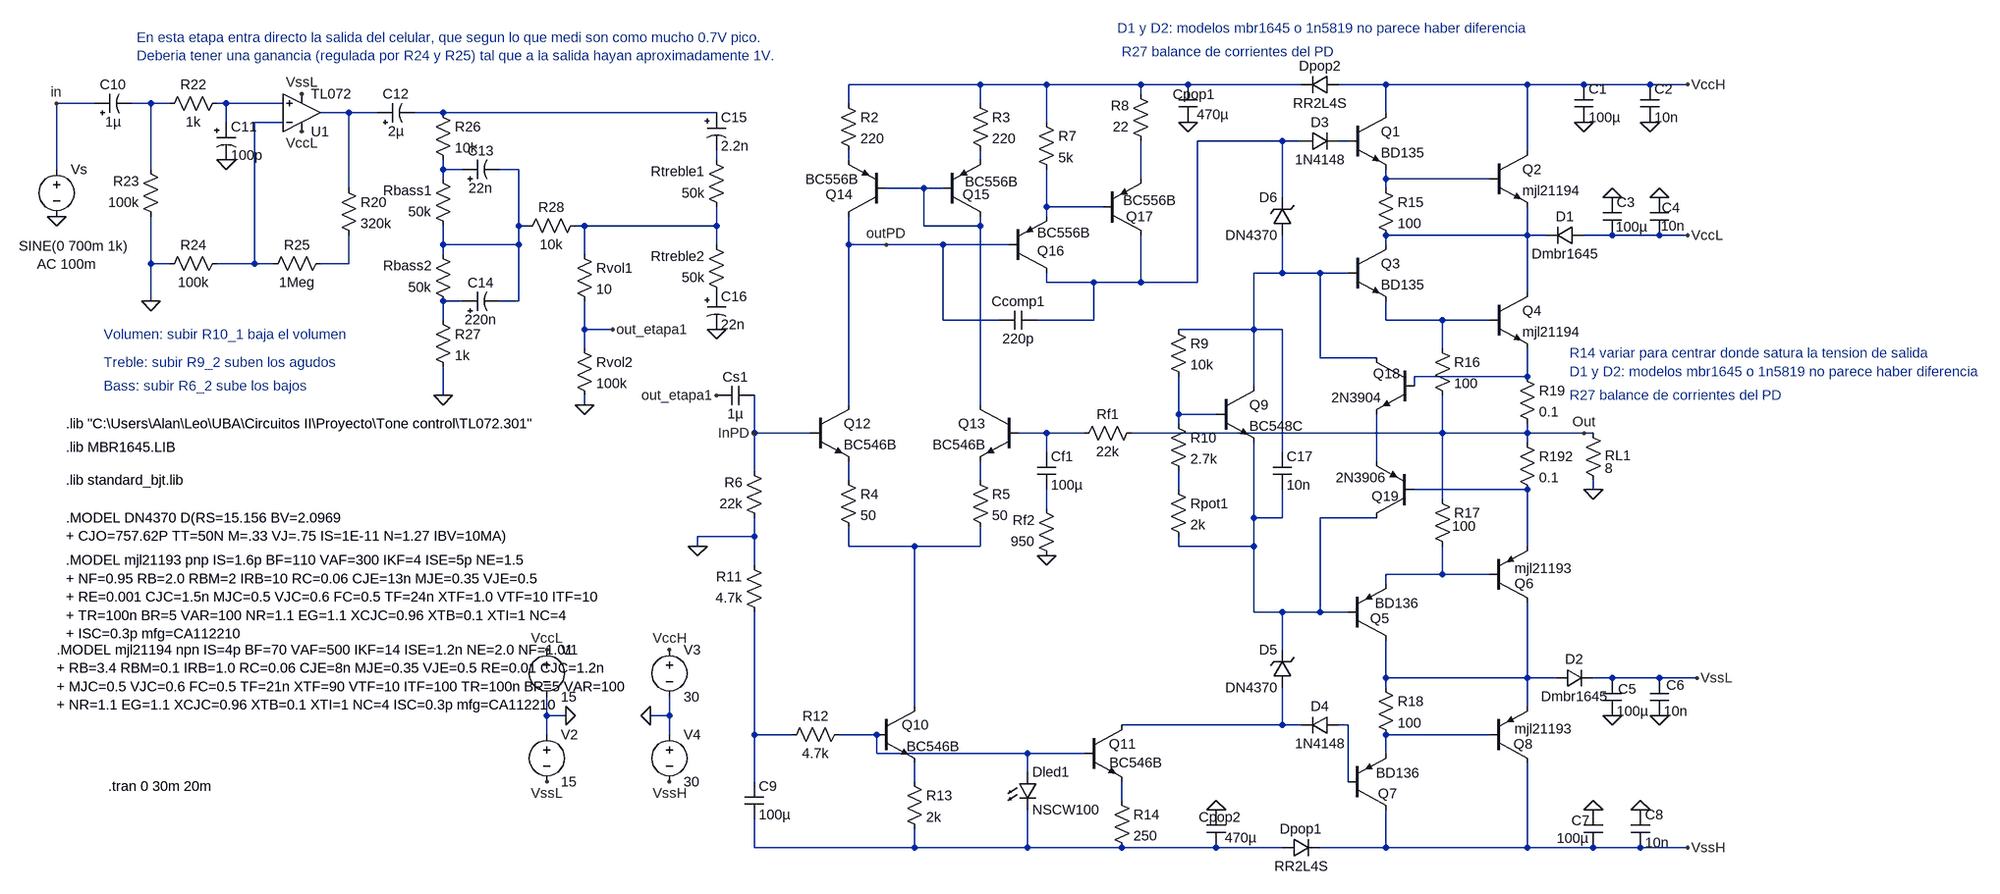
[diagram p0: schematic circuito_completo.asc]
circuito_completo.asc, the LTspice schematic file:
Version 4
SHEET 1 3596 1496
WIRE 1328 16 1104 16
WIRE 1440 16 1328 16
WIRE 1600 16 1440 16
WIRE 1680 16 1600 16
WIRE 1872 16 1680 16
WIRE 2016 16 1936 16
WIRE 2256 16 2016 16
WIRE 2352 16 2256 16
WIRE 2464 16 2352 16
WIRE 2528 16 2464 16
WIRE 1600 32 1600 16
WIRE -176 48 -240 48
WIRE -80 48 -112 48
WIRE -48 48 -80 48
WIRE 48 48 32 48
WIRE 144 48 48 48
WIRE 1104 48 1104 16
WIRE 1328 48 1328 16
WIRE 256 64 208 64
WIRE 304 64 256 64
WIRE 416 64 368 64
WIRE 880 64 416 64
WIRE 2016 64 2016 16
WIRE 48 80 48 48
WIRE 144 80 96 80
WIRE 1440 80 1440 16
WIRE 1840 112 1696 112
WIRE 1872 112 1840 112
WIRE 1952 112 1936 112
WIRE 2256 128 2256 16
WIRE 880 144 880 128
WIRE 1104 144 1104 128
WIRE 1328 144 1328 128
WIRE -240 160 -240 48
WIRE -80 160 -80 48
WIRE 416 160 416 144
WIRE 448 160 416 160
WIRE 544 160 512 160
WIRE 416 176 416 160
WIRE 1600 176 1600 112
WIRE 2016 176 2016 160
WIRE 2192 176 2016 176
WIRE 256 192 256 64
WIRE 1232 192 1168 192
WIRE 1264 192 1232 192
WIRE 2016 192 2016 176
WIRE 1840 208 1840 112
WIRE 1440 224 1440 160
WIRE 1536 224 1440 224
WIRE 1440 240 1440 224
WIRE 544 256 544 160
WIRE 560 256 544 256
WIRE 656 256 640 256
WIRE 880 256 880 224
WIRE 880 256 656 256
WIRE 1232 256 1232 192
WIRE 1328 256 1328 240
WIRE 1328 256 1232 256
WIRE 2256 272 2256 224
WIRE 2256 272 2016 272
WIRE 2288 272 2256 272
WIRE 2400 272 2352 272
WIRE 2480 272 2400 272
WIRE 2528 272 2480 272
WIRE 416 288 416 256
WIRE 544 288 544 256
WIRE 544 288 416 288
WIRE 880 288 880 256
WIRE 1104 288 1104 240
WIRE 1168 288 1104 288
WIRE 1264 288 1168 288
WIRE 1376 288 1264 288
WIRE 2016 288 2016 272
WIRE 416 304 416 288
WIRE 656 304 656 256
WIRE -80 320 -80 240
WIRE -48 320 -80 320
WIRE 96 320 96 80
WIRE 96 320 32 320
WIRE 128 320 96 320
WIRE 256 320 256 272
WIRE 256 320 208 320
WIRE 1840 336 1840 272
WIRE 1840 336 1792 336
WIRE 1904 336 1840 336
WIRE 1952 336 1904 336
WIRE 1440 352 1440 336
WIRE 1520 352 1440 352
WIRE 1600 352 1600 272
WIRE 1600 352 1520 352
WIRE 1696 352 1696 112
WIRE 1696 352 1600 352
WIRE 2256 368 2256 272
WIRE -80 384 -80 320
WIRE 448 384 416 384
WIRE 544 384 544 288
WIRE 544 384 512 384
WIRE 416 416 416 384
WIRE 1264 416 1264 288
WIRE 1360 416 1264 416
WIRE 1520 416 1520 352
WIRE 1520 416 1424 416
WIRE 2016 416 2016 384
WIRE 2112 416 2016 416
WIRE 2192 416 2112 416
WIRE 656 432 656 384
WIRE 704 432 656 432
WIRE 1792 432 1792 336
WIRE 1792 432 1664 432
WIRE 1840 432 1792 432
WIRE 656 464 656 432
WIRE 2112 464 2112 416
WIRE 1904 480 1904 336
WIRE 2000 480 1904 480
WIRE 2256 512 2256 464
WIRE 2256 512 2064 512
WIRE 1792 528 1792 432
WIRE 2064 528 2064 512
WIRE 416 544 416 496
WIRE 656 560 656 544
WIRE 1104 560 1104 288
WIRE 1328 560 1328 256
WIRE 1664 576 1664 512
WIRE 1728 576 1664 576
WIRE 1664 592 1664 576
WIRE 944 608 944 544
WIRE 1040 608 944 608
WIRE 1440 608 1392 608
WIRE 1504 608 1440 608
WIRE 2112 608 2112 544
WIRE 2112 608 1584 608
WIRE 2256 608 2256 592
WIRE 2256 608 2112 608
WIRE 2352 608 2256 608
WIRE 2368 608 2352 608
WIRE 2256 624 2256 608
WIRE 1440 640 1440 608
WIRE 1840 640 1840 432
WIRE 2000 656 2000 576
WIRE 944 672 944 608
WIRE 1104 688 1104 656
WIRE 1328 688 1328 656
WIRE 1664 704 1664 672
WIRE 2256 704 2064 704
WIRE 2368 704 2368 688
WIRE 2112 720 2112 608
WIRE 1440 736 1440 704
WIRE 1792 752 1792 624
WIRE 1840 752 1840 704
WIRE 1840 752 1792 752
WIRE 2000 752 1904 752
WIRE 944 784 944 752
WIRE 944 784 848 784
WIRE 848 800 848 784
WIRE 1104 800 1104 768
WIRE 1216 800 1104 800
WIRE 1328 800 1328 768
WIRE 1328 800 1216 800
WIRE 1664 800 1664 784
WIRE 1792 800 1792 752
WIRE 1792 800 1664 800
WIRE 2256 800 2256 704
WIRE 944 832 944 784
WIRE 2112 848 2112 800
WIRE 2112 848 2016 848
WIRE 2192 848 2112 848
WIRE 2016 864 2016 848
WIRE 1792 912 1792 800
WIRE 1840 912 1792 912
WIRE 1904 912 1904 752
WIRE 1904 912 1840 912
WIRE 1952 912 1904 912
WIRE 1840 976 1840 912
WIRE 2016 1024 2016 960
WIRE 2256 1024 2256 896
WIRE 2256 1024 2016 1024
WIRE 2304 1024 2256 1024
WIRE 2400 1024 2368 1024
WIRE 2480 1024 2400 1024
WIRE 2544 1024 2480 1024
WIRE 2016 1040 2016 1024
WIRE 1216 1072 1216 800
WIRE 2256 1072 2256 1024
WIRE 592 1088 592 1056
WIRE 624 1088 592 1088
WIRE 800 1088 800 1056
WIRE 800 1088 768 1088
WIRE 1840 1104 1840 1040
WIRE 1840 1104 1568 1104
WIRE 1872 1104 1840 1104
WIRE 1952 1104 1936 1104
WIRE 592 1120 592 1088
WIRE 800 1120 800 1088
WIRE 944 1120 944 912
WIRE 1008 1120 944 1120
WIRE 1152 1120 1088 1120
WIRE 2192 1120 2016 1120
WIRE 1152 1152 1152 1120
WIRE 1408 1152 1152 1152
WIRE 1504 1152 1408 1152
WIRE 2016 1152 2016 1120
WIRE 1408 1184 1408 1152
WIRE 944 1200 944 1120
WIRE 1216 1200 1216 1168
WIRE 1952 1200 1952 1104
WIRE 1568 1232 1568 1200
WIRE 944 1312 944 1264
WIRE 1216 1312 1216 1280
WIRE 1216 1312 944 1312
WIRE 1408 1312 1408 1248
WIRE 1408 1312 1216 1312
WIRE 1568 1312 1408 1312
WIRE 1728 1312 1568 1312
WIRE 1840 1312 1728 1312
WIRE 2016 1312 2016 1248
WIRE 2016 1312 1904 1312
WIRE 2256 1312 2256 1168
WIRE 2256 1312 2016 1312
WIRE 2368 1312 2256 1312
WIRE 2448 1312 2368 1312
WIRE 2528 1312 2448 1312
FLAG 624 1088 0
FLAG 768 1088 0
FLAG 800 976 VccH
FLAG 592 976 VccL
FLAG 800 1200 VssH
FLAG 592 1200 VssL
FLAG -240 240 0
FLAG 416 544 0
FLAG -80 384 0
FLAG 176 96 VccL
FLAG 176 32 VssL
FLAG 48 144 0
FLAG 656 560 0
FLAG 880 432 0
FLAG 704 432 out_etapa1
FLAG -240 48 in
FLAG 2528 272 VccL
FLAG 2528 16 VccH
FLAG 2368 704 0
FLAG 2528 1312 VssH
FLAG 2352 608 Out
FLAG 1440 816 0
FLAG 848 800 0
FLAG 2544 1024 VssL
FLAG 944 608 InPD
FLAG 1680 80 0
FLAG 1728 1248 0
FLAG 2400 1088 0
FLAG 2368 1248 0
FLAG 2400 208 0
FLAG 2352 80 0
FLAG 2464 80 0
FLAG 2448 1248 0
FLAG 2480 208 0
FLAG 2480 1088 0
FLAG 1168 288 outPD
FLAG 880 544 out_etapa1
SYMBOL voltage 592 960 R0
WINDOW 123 0 0 Left 0
WINDOW 39 0 0 Left 0
SYMATTR InstName V1
SYMATTR Value 15
SYMBOL voltage 592 1104 R0
WINDOW 123 0 0 Left 0
WINDOW 39 0 0 Left 0
SYMATTR InstName V2
SYMATTR Value 15
SYMBOL voltage 800 960 R0
WINDOW 123 0 0 Left 0
WINDOW 39 0 0 Left 0
SYMATTR InstName V3
SYMATTR Value 30
SYMBOL voltage 800 1104 R0
WINDOW 123 0 0 Left 0
WINDOW 39 0 0 Left 0
SYMATTR InstName V4
SYMATTR Value 30
SYMBOL polcap -176 64 R270
WINDOW 0 32 32 VTop 2
WINDOW 3 0 32 VBottom 2
SYMATTR InstName C10
SYMATTR Value 1µ
SYMBOL polcap 32 80 R0
SYMATTR InstName C11
SYMATTR Value 100p
SYMBOL polcap 304 80 R270
WINDOW 0 32 32 VTop 2
WINDOW 3 0 32 VBottom 2
SYMATTR InstName C12
SYMATTR Value 2µ
SYMBOL polcap 448 176 R270
WINDOW 0 32 32 VTop 2
WINDOW 3 0 32 VBottom 2
SYMATTR InstName C13
SYMATTR Value 22n
SYMBOL polcap 448 400 R270
WINDOW 0 32 32 VTop 2
WINDOW 3 0 32 VBottom 2
SYMATTR InstName C14
SYMATTR Value 220n
SYMBOL polcap 864 64 R0
SYMATTR InstName C15
SYMATTR Value 2.2n
SYMBOL polcap 864 368 R0
SYMATTR InstName C16
SYMATTR Value 22n
SYMBOL res 48 32 R90
WINDOW 0 0 56 VBottom 2
WINDOW 3 32 56 VTop 2
SYMATTR InstName R22
SYMATTR Value 1k
SYMBOL res -64 256 R180
WINDOW 0 36 76 Left 2
WINDOW 3 36 40 Left 2
SYMATTR InstName R23
SYMATTR Value 100k
SYMBOL res -64 336 R270
WINDOW 0 32 56 VTop 2
WINDOW 3 0 56 VBottom 2
SYMATTR InstName R24
SYMATTR Value 100k
SYMBOL res 112 336 R270
WINDOW 0 32 56 VTop 2
WINDOW 3 0 56 VBottom 2
SYMATTR InstName R25
SYMATTR Value 1Meg
SYMBOL res 400 48 R0
SYMATTR InstName R26
SYMATTR Value 10k
SYMBOL res 432 400 R180
WINDOW 0 36 76 Left 2
WINDOW 3 36 40 Left 2
SYMATTR InstName Rbass2
SYMATTR Value 50k
SYMBOL res 400 400 R0
SYMATTR InstName R27
SYMATTR Value 1k
SYMBOL res 656 240 R90
WINDOW 0 0 56 VBottom 2
WINDOW 3 32 56 VTop 2
SYMATTR InstName R28
SYMATTR Value 10k
SYMBOL res 896 240 R180
WINDOW 0 36 76 Left 2
WINDOW 3 36 40 Left 2
SYMATTR InstName Rtreble1
SYMATTR Value 50k
SYMBOL res 640 288 R0
SYMATTR InstName Rvol1
SYMATTR Value 10
SYMBOL voltage -240 144 R0
WINDOW 123 -33 177 Left 2
WINDOW 39 0 0 Left 0
WINDOW 3 -64 146 Left 2
SYMATTR Value2 AC 100m
SYMATTR Value SINE(0 700m 1k)
SYMATTR InstName Vs
SYMBOL Opamps\\opamp2 176 128 M180
SYMATTR InstName U1
SYMATTR Value TL072
SYMBOL res 432 272 R180
WINDOW 0 36 76 Left 2
WINDOW 3 36 40 Left 2
SYMATTR InstName Rbass1
SYMATTR Value 50k
SYMBOL res 896 384 R180
WINDOW 0 36 76 Left 2
WINDOW 3 36 40 Left 2
SYMATTR InstName Rtreble2
SYMATTR Value 50k
SYMBOL res 640 448 R0
SYMATTR InstName Rvol2
SYMATTR Value 100k
SYMBOL res 2352 592 R0
WINDOW 0 36 54 Left 2
SYMATTR InstName RL1
SYMATTR Value 8
SYMBOL diode 1872 128 R270
WINDOW 0 32 32 VTop 2
WINDOW 3 0 32 VBottom 2
SYMATTR InstName D3
SYMATTR Value 1N4148
SYMBOL diode 1936 1088 R90
WINDOW 0 0 32 VBottom 2
WINDOW 3 32 32 VTop 2
SYMATTR InstName D4
SYMATTR Value 1N4148
SYMBOL npn 1728 528 R0
SYMATTR InstName Q9
SYMATTR Value BC548C
SYMBOL res 1648 416 R0
SYMATTR InstName R9
SYMATTR Value 10k
SYMBOL res 1648 576 R0
SYMATTR InstName R10
SYMATTR Value 2.7k
SYMBOL npn 1504 1104 R0
WINDOW 0 42 32 Left 2
WINDOW 3 43 64 Left 2
SYMATTR InstName Q11
SYMATTR Value BC546B
SYMBOL res 1552 1216 R0
SYMATTR InstName R14
SYMATTR Value 250
SYMBOL npn 1392 560 M0
SYMATTR InstName Q13
SYMATTR Value BC546B
SYMBOL res 1600 592 R90
WINDOW 0 0 56 VBottom 2
WINDOW 3 32 56 VTop 2
SYMATTR InstName Rf1
SYMATTR Value 22k
SYMBOL res 1456 832 R180
WINDOW 0 36 76 Left 2
WINDOW 3 36 40 Left 2
SYMATTR InstName Rf2
SYMATTR Value 950
SYMBOL cap 1424 640 R0
SYMATTR InstName Cf1
SYMATTR Value 100µ
SYMBOL npn 1040 560 R0
SYMATTR InstName Q12
SYMATTR Value BC546B
SYMBOL npn 1152 1072 R0
WINDOW 0 42 32 Left 2
WINDOW 3 51 68 Left 2
SYMATTR InstName Q10
SYMATTR Value BC546B
SYMBOL res 1200 1184 R0
SYMATTR InstName R13
SYMATTR Value 2k
SYMBOL res 1104 1104 R90
WINDOW 0 0 56 VBottom 2
WINDOW 3 32 56 VTop 2
SYMATTR InstName R12
SYMATTR Value 4.7k
SYMBOL res 960 768 R180
WINDOW 0 36 76 Left 2
WINDOW 3 36 40 Left 2
SYMATTR InstName R6
SYMATTR Value 22k
SYMBOL res 960 928 R180
WINDOW 0 36 76 Left 2
WINDOW 3 36 40 Left 2
SYMATTR InstName R11
SYMATTR Value 4.7k
SYMBOL cap 928 1200 R0
SYMATTR InstName C9
SYMATTR Value 100µ
SYMBOL cap 944 528 R90
WINDOW 0 0 32 VBottom 2
WINDOW 3 32 32 VTop 2
SYMATTR InstName Cs1
SYMATTR Value 1µ
SYMBOL pnp 1168 240 R180
WINDOW 0 57 37 Left 2
WINDOW 3 48 63 Left 2
SYMATTR InstName Q14
SYMATTR Value BC556B
SYMBOL pnp 1264 240 M180
WINDOW 0 34 37 Left 2
WINDOW 3 38 59 Left 2
SYMATTR InstName Q15
SYMATTR Value BC556B
SYMBOL res 1424 64 R0
SYMATTR InstName R7
SYMATTR Value 5k
SYMBOL pnp 1376 336 M180
WINDOW 0 48 37 Left 2
WINDOW 3 48 68 Left 2
SYMATTR InstName Q16
SYMATTR Value BC556B
SYMBOL zener 1856 1040 R180
WINDOW 0 24 64 Left 2
WINDOW 3 24 0 Left 2
SYMATTR InstName D5
SYMATTR Value DN4370
SYMBOL zener 1856 272 R180
WINDOW 0 24 64 Left 2
WINDOW 3 24 0 Left 2
SYMATTR InstName D6
SYMATTR Value DN4370
SYMBOL LED 1392 1184 R0
SYMATTR InstName Dled1
SYMATTR Value NSCW100
SYMBOL res 1616 128 R180
WINDOW 0 36 76 Left 2
WINDOW 3 36 40 Left 2
SYMATTR InstName R8
SYMATTR Value 22
SYMBOL pnp 1536 272 M180
WINDOW 0 39 32 Left 2
WINDOW 3 34 59 Left 2
SYMATTR InstName Q17
SYMATTR Value BC556B
SYMBOL cap 1424 400 R90
WINDOW 0 0 32 VBottom 2
WINDOW 3 32 32 VTop 2
SYMATTR InstName Ccomp1
SYMATTR Value 220p
SYMBOL diode 1840 1328 R270
WINDOW 0 32 32 VTop 2
WINDOW 3 0 32 VBottom 2
SYMATTR InstName Dpop1
SYMATTR Value RR2L4S
SYMBOL diode 1936 0 R90
WINDOW 0 0 32 VBottom 2
WINDOW 3 32 32 VTop 2
SYMATTR InstName Dpop2
SYMATTR Value RR2L4S
SYMBOL cap 1696 80 R180
WINDOW 0 -30 47 Left 2
WINDOW 3 -53 13 Left 2
SYMATTR InstName Cpop1
SYMATTR Value 470µ
SYMBOL cap 1744 1312 R180
WINDOW 0 -26 52 Left 2
WINDOW 3 -53 17 Left 2
SYMATTR InstName Cpop2
SYMATTR Value 470µ
SYMBOL cap 2352 1248 R0
WINDOW 0 -21 18 Left 2
WINDOW 3 -46 48 Left 2
SYMATTR InstName C7
SYMATTR Value 100µ
SYMBOL cap 2336 16 R0
SYMATTR InstName C1
SYMATTR Value 100µ
SYMBOL cap 2384 208 R0
WINDOW 3 22 50 Left 2
SYMATTR Value 100µ
SYMATTR InstName C3
SYMBOL cap 2384 1024 R0
WINDOW 0 26 19 Left 2
SYMATTR InstName C5
SYMATTR Value 100µ
SYMBOL res 1088 32 R0
SYMATTR InstName R2
SYMATTR Value 220
SYMBOL res 1312 32 R0
SYMATTR InstName R3
SYMATTR Value 220
SYMBOL cap 2448 16 R0
SYMATTR InstName C2
SYMATTR Value 10n
SYMBOL cap 2432 1248 R0
SYMATTR InstName C8
SYMATTR Value 10n
SYMBOL cap 2464 208 R0
WINDOW 0 20 17 Left 2
WINDOW 3 19 48 Left 2
SYMATTR InstName C4
SYMATTR Value 10n
SYMBOL cap 2464 1024 R0
WINDOW 0 28 12 Left 2
SYMATTR InstName C6
SYMATTR Value 10n
SYMBOL diode 2304 1040 R270
WINDOW 0 32 32 VTop 2
WINDOW 3 0 32 VBottom 2
SYMATTR InstName D2
SYMATTR Value Dmbr1645
SYMBOL diode 2352 256 R90
WINDOW 0 0 32 VBottom 2
WINDOW 3 32 32 VTop 2
SYMATTR InstName D1
SYMATTR Value Dmbr1645
SYMBOL npn 2064 480 M0
WINDOW 0 24 27 Left 2
SYMATTR InstName Q18
SYMATTR Value 2N3904
SYMBOL pnp 2064 752 R180
WINDOW 0 26 37 Left 2
WINDOW 3 48 68 Left 2
SYMATTR InstName Q19
SYMATTR Value 2N3906
SYMBOL res 1088 672 R0
SYMATTR InstName R4
SYMATTR Value 50
SYMBOL res 1312 672 R0
SYMATTR InstName R5
SYMATTR Value 50
SYMBOL res 2240 608 R0
SYMATTR InstName R192
SYMATTR Value 0.1
SYMBOL res 2240 496 R0
SYMATTR InstName R19
SYMATTR Value 0.1
SYMBOL npn 1952 288 R0
SYMATTR InstName Q3
SYMATTR Value BD135
SYMBOL npn 2192 368 R0
SYMATTR InstName Q4
SYMATTR Value mjl21194
SYMBOL npn 1952 64 R0
SYMATTR InstName Q1
SYMATTR Value BD135
SYMBOL npn 2192 128 R0
SYMATTR InstName Q2
SYMATTR Value mjl21194
SYMBOL pnp 2192 896 M180
WINDOW 0 42 32 Left 2
WINDOW 3 42 58 Left 2
SYMATTR InstName Q6
SYMATTR Value mjl21193
SYMBOL pnp 1952 960 M180
WINDOW 0 37 37 Left 2
WINDOW 3 46 63 Left 2
SYMATTR InstName Q5
SYMATTR Value BD136
SYMBOL pnp 2192 1168 M180
WINDOW 0 41 32 Left 2
WINDOW 3 42 58 Left 2
SYMATTR InstName Q8
SYMATTR Value mjl21193
SYMBOL pnp 1952 1248 M180
WINDOW 0 51 28 Left 2
WINDOW 3 47 63 Left 2
SYMATTR InstName Q7
SYMATTR Value BD136
SYMBOL res 2000 1024 R0
SYMATTR InstName R18
SYMATTR Value 100
SYMBOL res 2096 704 R0
WINDOW 3 73 62 Right 2
SYMATTR Value 100
SYMATTR InstName R17
SYMBOL res 2096 448 R0
SYMATTR InstName R16
SYMATTR Value 100
SYMBOL res 2000 176 R0
SYMATTR InstName R15
SYMATTR Value 100
SYMBOL res 1648 688 R0
SYMATTR InstName Rpot1
SYMATTR Value 2k
SYMBOL cap 1824 640 R0
SYMATTR InstName C17
SYMATTR Value 10n
SYMBOL res 240 176 R0
SYMATTR InstName R20
SYMATTR Value 320k
TEXT -224 688 Left 2 !.lib standard_bjt.lib
TEXT -152 1208 Left 2 !.tran 0 30m 20m
TEXT -224 632 Left 2 !.lib MBR1645.LIB
TEXT 1560 -80 Left 2 ;D1 y D2: modelos mbr1645 o 1n5819 no parece haber diferencia
TEXT 1568 -40 Left 2 ;R27 balance de corrientes del PD
TEXT -224 592 Left 2 !.lib "C:\\Users\\Alan\\Leo\\UBA\\Circuitos II\\Proyecto\\Tone control\\TL072.301"
TEXT -160 440 Left 2 ;Volumen: subir R10_1 baja el volumen
TEXT -104 -64 Left 2 ;En esta etapa entra directo la salida del celular, que segun lo que medi son como mucho 0.7V pico.\nDeberia tener una ganancia (regulada por R24 y R25) tal que a la salida hayan aproximadamente 1V.
TEXT -160 488 Left 2 ;Treble: subir R9_2 suben los agudos
TEXT -160 528 Left 2 ;Bass: subir R6_2 sube los bajos
TEXT 2328 504 Left 2 ;D1 y D2: modelos mbr1645 o 1n5819 no parece haber diferencia
TEXT 2328 544 Left 2 ;R27 balance de corrientes del PD
TEXT 2328 472 Left 2 ;R14 variar para centrar donde satura la tension de salida
TEXT -224 824 Left 2 !.MODEL mjl21193 pnp IS=1.6p BF=110 VAF=300 IKF=4 ISE=5p NE=1.5\n+ NF=0.95 RB=2.0 RBM=2 IRB=10 RC=0.06 CJE=13n MJE=0.35 VJE=0.5\n+ RE=0.001 CJC=1.5n MJC=0.5 VJC=0.6 FC=0.5 TF=24n XTF=1.0 VTF=10 ITF=10\n+ TR=100n BR=5 VAR=100 NR=1.1 EG=1.1 XCJC=0.96 XTB=0.1 XTI=1 NC=4\n+ ISC=0.3p mfg=CA112210
TEXT -240 976 Left 2 !.MODEL mjl21194 npn IS=4p BF=70 VAF=500 IKF=14 ISE=1.2n NE=2.0 NF=1.01\n+ RB=3.4 RBM=0.1 IRB=1.0 RC=0.06 CJE=8n MJE=0.35 VJE=0.5 RE=0.01 CJC=1.2n\n+ MJC=0.5 VJC=0.6 FC=0.5 TF=21n XTF=90 VTF=10 ITF=100 TR=100n BR=5 VAR=100\n+ NR=1.1 EG=1.1 XCJC=0.96 XTB=0.1 XTI=1 NC=4 ISC=0.3p mfg=CA112210
TEXT -224 752 Left 2 !.MODEL DN4370 D(RS=15.156 BV=2.0969     \n+ CJO=757.62P TT=50N M=.33 VJ=.75 IS=1E-11 N=1.27 IBV=10MA)

The netlist it stands for:
* circuito_completo.asc
V1 VccL 0 15
V2 0 VssL 15
V3 VccH 0 30
V4 0 VssH 30
C10 in N002 1µ
C11 N003 0 100p
C12 N004 N005 2µ
C13 N012 N013 22n
C14 N022 N013 220n
C15 N005 N009 2.2n
C16 P001 0 22n
R22 N003 N002 1k
R23 0 N002 100k
R24 0 N006 100k
R25 N006 N020 1Meg
R26 N005 N012 10k
Rbass2 N022 N013 50k
R27 N022 0 1k
R28 N018 N013 10k
Rtreble1 N018 N009 50k
Rvol1 N018 out_etapa1 10
Vs in 0 SINE(0 700m 1k) AC 100m
XU1 N003 N006 VccL VssL N004 TL072  ; pins In+ In- V+ V- OUT
Rbass1 N013 N012 50k
Rtreble2 P001 N018 50k
Rvol2 out_etapa1 0 100k
RL1 Out 0 8
D3 N007 N008 1N4148
D4 N038 N037 1N4148
Q9 N021 N025 N033 0 BC548C
R9 N021 N025 10k
R10 N025 N030 2.7k
Q11 N037 N040 N043 0 BC546B
R14 N043 N044 250
Q13 N016 N026 N029 0 BC546B
Rf1 Out N026 22k
Rf2 0 N032 950
Cf1 N026 N032 100µ
Q12 outPD InPD N028 0 BC546B
Q10 N034 N040 N042 0 BC546B
R13 N042 N044 2k
R12 N040 N039 4.7k
R6 0 InPD 22k
R11 N039 0 4.7k
C9 N039 N044 100µ
Cs1 InPD out_etapa1 1µ
Q14 outPD N016 N010 0 BC556B
Q15 N016 N016 N011 0 BC556B
R7 N001 N017 5k
Q16 N007 outPD N017 0 BC556B
D5 N037 N033 DN4370
D6 N021 N007 DN4370
Dled1 N040 N044 NSCW100
R8 N014 N001 22
Q17 N007 N017 N014 0 BC556B
Ccomp1 N007 outPD 220p
Dpop1 N044 VssH RR2L4S
Dpop2 VccH N001 RR2L4S
Cpop1 0 N001 470µ
Cpop2 N044 0 470µ
C7 0 VssH 100µ
C1 VccH 0 100µ
C3 0 VccL 100µ
C5 VssL 0 100µ
R2 N001 N010 220
R3 N001 N011 220
C2 VccH 0 10n
C8 0 VssH 10n
C4 0 VccL 10n
C6 VssL 0 10n
D2 N036 VssL Dmbr1645
D1 VccL N019 Dmbr1645
Q18 N021 N024 N027 0 2N3904
Q19 N033 N031 N027 0 2N3906
R4 N028 N034 50
R5 N029 N034 50
R192 Out N031 0.1
R19 N024 Out 0.1
Q3 N019 N021 N023 0 BD135
Q4 N019 N023 N024 0 mjl21194
Q1 VccH N008 N015 0 BD135
Q2 VccH N015 N019 0 mjl21194
Q6 N036 N035 N031 0 mjl21193
Q5 N036 N033 N035 0 BD136
Q8 VssH N041 N036 0 mjl21193
Q7 VssH N038 N041 0 BD136
R18 N036 N041 100
R17 Out N035 100
R16 N023 Out 100
R15 N015 N019 100
Rpot1 N030 N033 2k
C17 N021 N033 10n
R20 N004 N020 320k
.model D D
.lib standard.dio
.model NPN NPN
.model PNP PNP
.lib standard.bjt
.lib standard_bjt.lib
.tran 0 30m 20m
.lib MBR1645.LIB
* D1 y D2: modelos mbr1645 o 1n5819 no parece haber diferencia
* R27 balance de corrientes del PD
.lib "C:\Users\Alan\Leo\UBA\Circuitos II\Proyecto\Tone control\TL072.301"
* Volumen: subir R10_1 baja el volumen
* En esta etapa entra directo la salida del celular, que segun lo que medi son como mucho 0.7V pico.
* Deberia tener una ganancia (regulada por R24 y R25) tal que a la salida hayan aproximadamente 1V.
* Treble: subir R9_2 suben los agudos
* Bass: subir R6_2 sube los bajos
* D1 y D2: modelos mbr1645 o 1n5819 no parece haber diferencia
* R27 balance de corrientes del PD
* R14 variar para centrar donde satura la tension de salida
.MODEL mjl21193 pnp IS=1.6p BF=110 VAF=300 IKF=4 ISE=5p NE=1.5
+ NF=0.95 RB=2.0 RBM=2 IRB=10 RC=0.06 CJE=13n MJE=0.35 VJE=0.5
+ RE=0.001 CJC=1.5n MJC=0.5 VJC=0.6 FC=0.5 TF=24n XTF=1.0 VTF=10 ITF=10
+ TR=100n BR=5 VAR=100 NR=1.1 EG=1.1 XCJC=0.96 XTB=0.1 XTI=1 NC=4
+ ISC=0.3p mfg=CA112210
.MODEL mjl21194 npn IS=4p BF=70 VAF=500 IKF=14 ISE=1.2n NE=2.0 NF=1.01
+ RB=3.4 RBM=0.1 IRB=1.0 RC=0.06 CJE=8n MJE=0.35 VJE=0.5 RE=0.01 CJC=1.2n
+ MJC=0.5 VJC=0.6 FC=0.5 TF=21n XTF=90 VTF=10 ITF=100 TR=100n BR=5 VAR=100
+ NR=1.1 EG=1.1 XCJC=0.96 XTB=0.1 XTI=1 NC=4 ISC=0.3p mfg=CA112210
.MODEL DN4370 D(RS=15.156 BV=2.0969
+ CJO=757.62P TT=50N M=.33 VJ=.75 IS=1E-11 N=1.27 IBV=10MA)
.backanno
.end